# Altium schematic sheet motor-connections-power.SchDoc
size A4
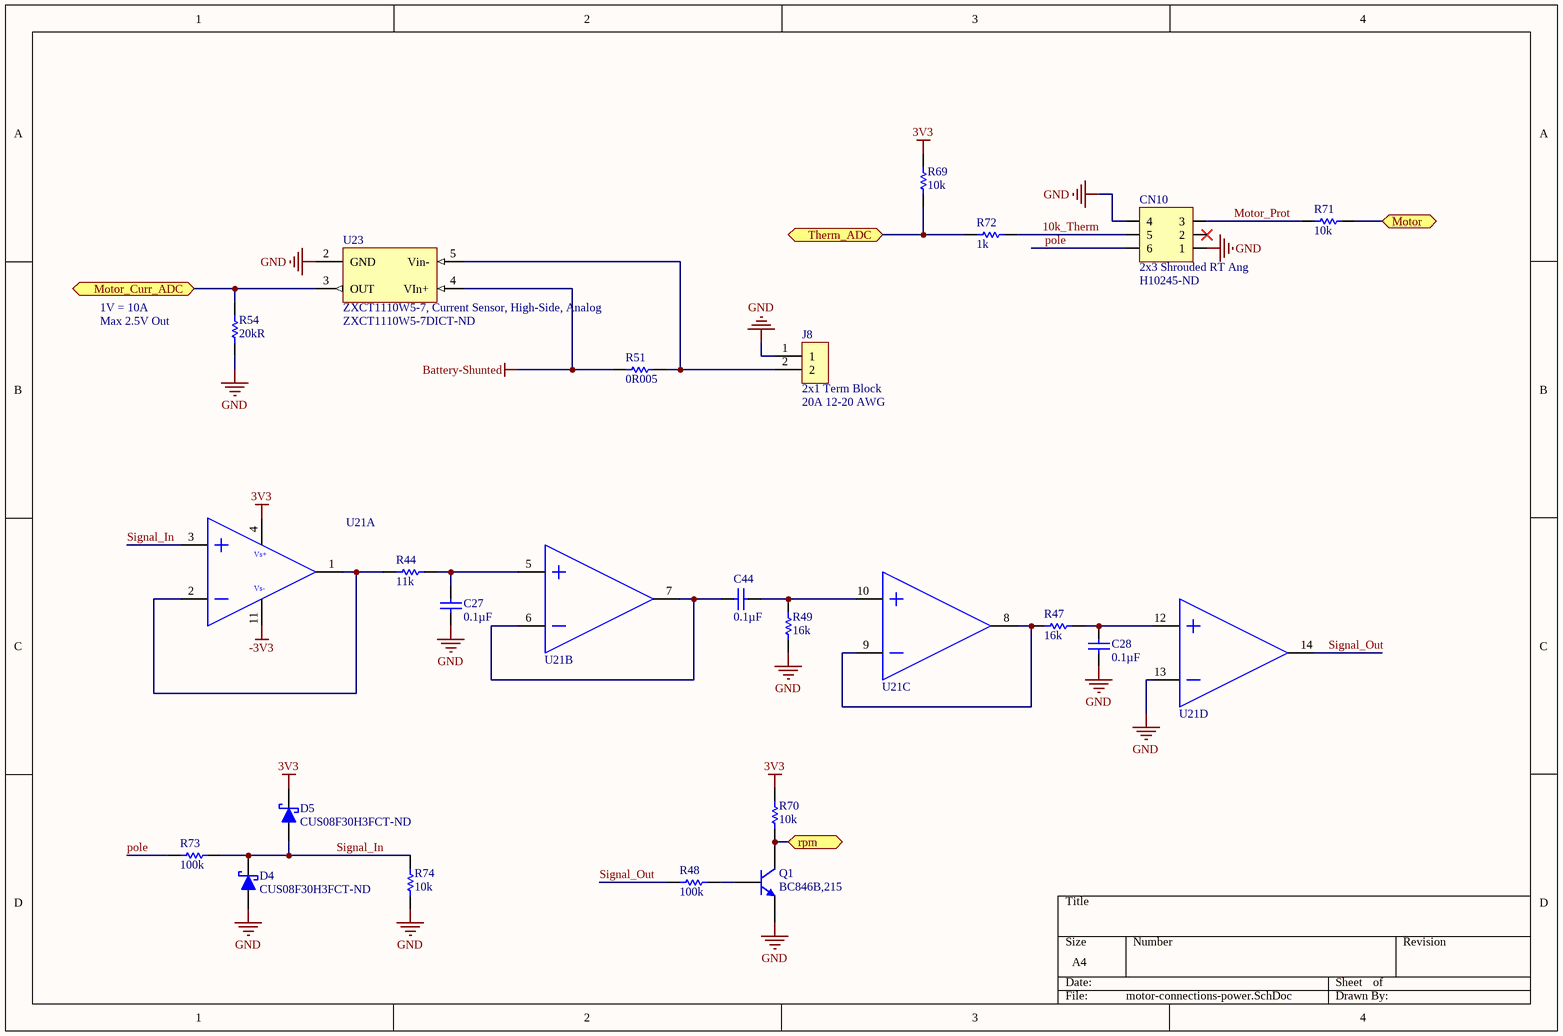
[diagram p0: motor-connections-power.SchDoc]

## Parts
C27  Capacitance: 0.1µF  [CAPC1608N(0603")]  (hidden comment: 0.1uF, 50V, 10%, X7R, 1608)
C28  Capacitance: 0.1µF  [CAPC1608N(0603")]  (hidden comment: 0.1uF, 50V, 10%, X7R, 1608)
C44  Capacitance: 0.1µF  [CAPC1608N(0603")]  (hidden comment: 0.1uF, 50V, 10%, X7R, 1608)
CN10  2x3 Shrouded RT Ang  Supplier Part Number 1: H10245-ND  [HEADER, MALE, Shrouded, 6POS, 2MM, RT ANG,THT]
D4  CUS08F30H3FCT-ND  [SC-76]
D5  CUS08F30H3FCT-ND  [SC-76]
J8  2x1 Term Block  [2X1 Terminal Blocks Phoenix Contact 5mm]
Q1  BC846B,215  [SOT-23]
R44  11k  [RESC1608N(0603")]
R47  16k  [RESC1608N(0603")]
R48  100k  [RESC1608N(0603")]
R49  16k  [RESC1608N(0603")]
R51  0R005  [RESC6332N(2512")]
R54  20kR  [RESC1608N(0603")]
R69  10k  [RESC1608N(0603")]
R70  10k  [RESC1608N(0603")]
R71  10k  [RESC1608N(0603")]
R72  1k  [RESC1608N(0603")]
R73  100k  [RESC1608N(0603")]
R74  10k  [RESC1608N(0603")]
U21  Quad Op Amp TSV324  [SOP-14]  (value not drawn)  (parts A,B,C,D of 4)
U23  ZXCT1110W5-7, Current Sensor, High-Side, Analog  Supplier Part Number 1: ZXCT1110W5-7DICT-ND  [SOT23-5]

## Ports
Motor, Motor_Curr_ADC, rpm, Therm_ADC

## Nets
3V3: D5.K(Cathode) R69.2 R70.2 U21.4(Vcc+)
-3V3: U21.11(Vcc-)
Battery-Shunted: R51.2 U23.4(VIn+)
GND: C27.1(Anode) C28.1(Anode) CN10.1 CN10.4 D4.A(Anode) J8.1 Q1.2(E) R49.1 R54.1 R74.1 U21.13(Inverting_Input_3) U23.2(GND)
10k_Therm: CN10.5 R72.2
Motor: R71.1 ; port Motor
Motor_Curr_ADC: R54.2 U23.3(OUT) ; port Motor_Curr_ADC
Motor_Prot: CN10.3 R71.2
pole: CN10.6 R73.2
rpm: Q1.3(C) R70.1 ; port rpm
Signal_In: D4.K(Cathode) D5.A(Anode) R73.1 R74.2 U21.3(Non-Inverting_Input_1)
Signal_Out: R48.1 U21.14(Output_4)
Therm_ADC: R69.1 R72.1 ; port Therm_ADC
NetC27_2: C27.2(Cathode) R44.2 U21.5(Non-Inverting_Input_2)
NetC28_2: C28.2(Cathode) R47.1 U21.12(Non-Inverting_Input_4)
NetC44_1: C44.1(Anode) U21.6(Inverting_Input_2) U21.7(Output_2)
NetC44_2: C44.2(Cathode) R49.2 U21.10(Non-Inverting_Input_3)
NetJ8_2: J8.2 R51.1 U23.5(Vin-)
NetQ1_1: Q1.1(B) R48.2
NetR44_1: R44.1 U21.1(Output_1) U21.2(Inverting_Input_1)
NetR47_2: R47.2 U21.8(Output_3) U21.9(Inverting_Input_3)

Not connected (* = marked no-connect by the designer): CN10 2*

## Notes on the sheet
- 1V = 10A
- Max 2.5V Out
- (near J8) 20A 12-20 AWG
- (in symbol Quad Op Amp TSV324, part A) Vs+; Vs-

## Library data of the parts
C27 C28 C44 = 0.1uF, 50V, 10%, X7R, 1608: CAP CER 0.1UF 50V 10% X7R 1608 (0603); Manufacturer: Samsung Electro-Mechanics America, Inc; Manufacturer Part Number: CL10B104KB8SFNC; Supplier 1: Digi-Key; RoHS: RoHS Compliant; Category: Capacitors; Stock 1: 743572; Pricing 1: 1=0.12, 10=0.033, 25=0.0232, 100=0.0152, 500=0.01064, 1000=0.00829 (CAD); Packaging: Cut Tape (CT); Tolerance: ±10%; Voltage - Rated: 50V; Temperature Coefficient: X7R; Mounting Type: Surface Mount, MLCC; Operating Temperature: -55°C ~ 125°C; Applications: Boardflex Sensitive; Ratings: -; Package / Case: 0603 (1608 Metric); Size / Dimension: 0.063" L x 0.031" W (1.60mm x 0.80mm); Height - Seated (Max): -; Thickness (Max): 0.035" (0.90mm); Lead Spacing: -; Features: Soft Termination; Lead Style: -; ComponentLink1URL: http://www.samsungsem.com/servlet/FileDownload?type=spec&file=CL10B104KB8SFNC.pdf; ComponentLink1Description: http://www.samsungsem.com/servlet/FileDownload?type=spec&file=CL10B104KB8SFNC.pdf; Supplier Part Number 1: 1276-1936-1-ND
CN10 = Header, Male, 2x3 Conn, Shrouded, THT, 2MM RT ANG TIN: Header, Male, 2x3, Pitch: 0.1" (2.54mm), THT; Publisher: AUVic; Date Published: 2017-09-13; Last Updated: *; Reviewed By: *; Created By: Andy Bates; Supplier 1: Digi-Key
D4 D5 = CUS08F30H3FCT-ND: Diode, Schottky, 30V, 800mA; Created By: Andy Bates; Publisher: AUVic; Date Created: 2016-09-09; Supplier 1: Digi-Key; Supplier Part Number 1: CUS08F30H3FCT-ND
J8 = 2x1 Terminal Block, 20A, 12-20AWG: Made by: Andy Bates; Date Made: 2017-11-14; Supplier 1: Digi-Key; Supplier Part Number 1: 277-6405-ND
Q1 = BC846B,215: NPN 65V 100mA 250mW; Published: 8-Jun-2000; LatestRevisionDate: 09-Sep-2016; DatasheetVersion: 1997; Publisher: Andy Bates; Supplier 1: Digi-Key; Supplier Part Number 1: 568-1632-1-ND
R44 = 11kR, 1%, 1/10W, 0603 SMD: Made By: Ashwin Sira; Owned By: AUVic; Created On: 14-05-31; Last Edited: 14-05-31; Value: 11k; Supplier 1: Digi-Key; Supplier Part Number 1: 311-11.0KHRCT-ND
R47 R49 = 16kR, 1%, 1/10W, 0603 SMD: Made By: Ashwin Sira; Owned By: AUVic; Created On: 14-05-31; Last Edited: 14-05-31; Supplier 1: Digi-Key; Value: 16k; Supplier Part Number 1: 311-16.0KHRCT-ND
R48 R73 = 100kR, 1%, 1/10W, 0603 SMD: Made By: Andy Bates; Owned By: AUVic; Created On: 14-06-30; Last Edited: 14-06-30; Value: 100k; Supplier 1: Digi-Key; Supplier Part Number 1: 311-100KGRCT-ND
R51 = 0R005, 1%, 3W, 2512 SMD: MFG: Riedon; Created By: Andy Bates; Created On: 10-Nov-2017; Value: 0R005; Publisher: AUVic; Supplier 1: Digi-Key; Supplier Part Number 1: CRE2512-FZ-R005E-3CT-ND
R54 = 20k, 1%, 1/10W, 0603, SMD: Created By: Andy Bates; Publisher: AUVic; Date Created: 2016-09-8; Value: 20kR; Supplier 1: Digi-Key; Supplier Part Number 1: 311-20.0KHRCT-ND
R69-R71 R74 = 10kR, 1%, 1/10W, 0603 SMD: Made By: Ashwin Sira; Owned By: AUVic; Created On: 14-05-31; Last Edited: 14-05-31; Supplier 1: Digi-Key; Supplier Part Number 1: 311-10.0KHRCT-ND; Value: 10k
R72 = 1kR, 1%, 1/10W , 0603, SMD: Created By: Andy Bates; Publisher: AUVic; Date Created: 2017-05-10; Value: 1k; Supplier 1: Digikey; Supplier Part Number 1: 311-1.00KHRCT-ND
U21 = Quad Op Amp TSV324: TSV324; LatestRevisionNote: Re-released for DXP Platform.; Publisher: Altium Limited; Created By: Jordan; Creation Date: 10/14/2016; Supplier: Digikey; Supplier Part Number: 497-8198-2-ND
U23 = ZXCT1110W5-7, Current Sensor, High-Side, Analog: Diodes Incorporated, ZXCT1110W5-7; Created By: Jacob Lower; Publisher: AUVic; Created On: 2016-03-16; Supplier 1: Digi-Key